# Altium project Hackster.PrjPcb
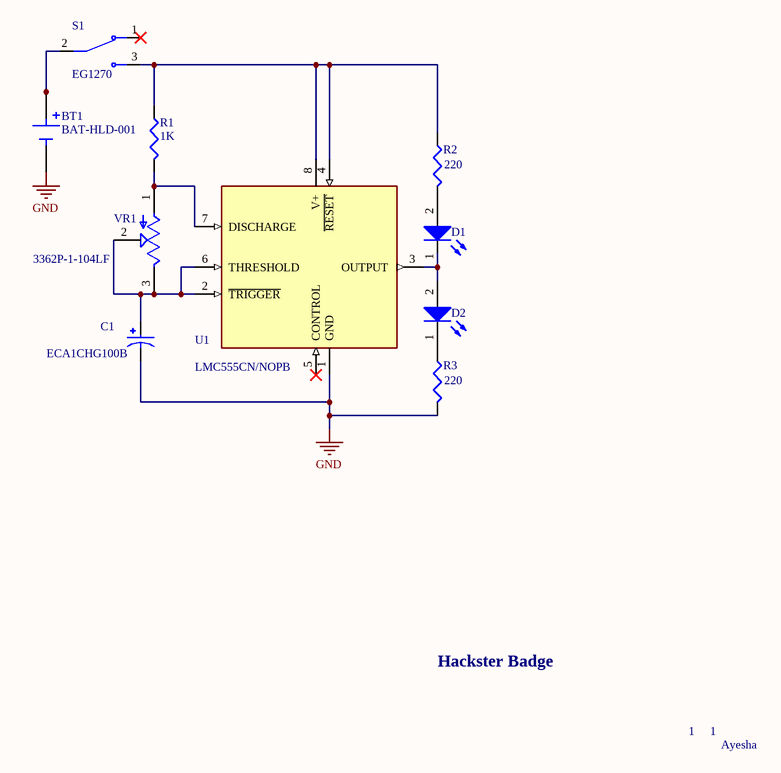
[diagram p0: Hackster.SchDoc]
1 sheet, 10 parts. Net scope: global (net labels, ports and power ports of the same name join across sheets).
Board file: hackster1.PcbDoc

## Sheet Hackster.SchDoc
size A; SheetNumber: 1; SheetTotal: 1

### Parts
BT1  BAT-HLD-001  [BAT_BAT-HLD-001]
C1  ECA1CHG100B  [CAPPRD500W50D500H1100]
D1  Blue, 2.8V, 30°  [WL-TMRW_D3.9H10.5]  (value not drawn)
D2  Blue, 2.8V, 30°  [WL-TMRW_D3.9H10.5]  (value not drawn)
R1  1K  [RESAD1100W55L680D260]
R2  220  [RESAD1100W55L680D260]
R3  220  [RESAD1100W55L680D260]
S1  EG1270  [SW_SS312SAH4-R]
U1  LMC555CN/NOPB  [DIP794W45P254L959H508Q8]
VR1  3362P-1-104LF  [TRIM_3362P-1-104LF]

### Nets
GND: BT1.N1(NEG) C1.N R3.2 U1.1(GND)
NetBT1_P1: BT1.P1(POS) BT1.P2(POS) S1.2
NetC1_P: C1.P U1.2(~{TRIGGER}) U1.6(THRESHOLD) VR1.2(WIPER) VR1.3(CW)
NetD1_1: D1.1(K) D2.2(A) U1.3(OUTPUT)
NetD1_2: D1.2(A) R2.2
NetD2_1: D2.1(K) R3.1
NetR1_1: R1.1 R2.1 S1.3 U1.4(~{RESET}) U1.8(V+)
NetR1_2: R1.2 U1.7(DISCHARGE) VR1.1(CCW)

Not connected (* = marked no-connect by the designer): S1 1*; U1 5(CONTROL)*

### Notes on the sheet
- Hackster Badge
- 1
- Ayesha

### Library data of the parts
BT1 = BAT-HLD-001: Battery Retainer Coin, 20.0mm 1 Cell SMD (SMT) Tab; Value: *; MP: BAT-HLD-001; Package: None; Availability: Unavailable; Price: None
C1 = ECA1CHG100B: Cap Aluminum Lytic 10uF 16V 20% (5 X 11mm) Radial 5mm 31mA 1000h 105C Automotive Ammo; MF: Panasonic Electronic; MP: ECA-1CHG100B; SnapEDA_Link: https://www.snapeda.com/parts/ECA-1CHG100B/Panasonic/view-part/?ref=snap; Package: RADIAL-2 Panasonic; Value: *; Check_prices: https://www.snapeda.com/parts/ECA-1CHG100B/Panasonic/view-part/?ref=eda
D1 D2 = 151033BS03000: WL-TMRW Mono-color Round Waterclear, THT, D3.9 x H10.5mm, Blue, 2.8V, 30°; Manufacturer: Wurth Elektronik; Chip Technology: InGaN; Dominant Wavelength: 470nm; Luminous Intensity: 3800mcd; Peak Wavelength: 465nm; Manufacturer Part Number: 151033BS03000; Category: Signal LEDs; Match Code: WL-TMRW; ComponentLink1Description: Website Link; ComponentLink1URL: https://www.we-online.com/redexpert/article/151033BS03000?ad; ComponentLink2Description: Datasheet Link; ComponentLink2URL: https://www.we-online.com/redexpert/spec/151033BS03000?ad; Mount: Through Hole; Operating Temperature Max: 85°C; Operating Temperature Min: -40°C; Packaging: Bulk; Height: 10.5mm; Diameter: 3.9mm; Emitting Color: Blue; Forward Voltage: 2.8V; Viewing Angle: 30°
R1-R3 = Res: Resistor
  R1: Value: 1K
  R2 R3: Value: 220
S1 = EG1270: Slide Switch SPDT Through Hole, Right Angle; MF: E-Switch; Availability: In Stock; Check_prices: https://www.snapeda.com/parts/EG1270/E-Switch/view-part/?ref=eda; SnapEDA_Link: https://www.snapeda.com/parts/EG1270/E-Switch/view-part/?ref=snap; Purchase-URL: https://pricing.snapeda.com/search/part/EG1270/?ref=eda; Package: None; MP: EG1270; Value: *; Price: None
U1 = LMC555CN/NOPB: Worldâ€™s smallest 555 timer with low power, high accuracy and a Fmax of 3MHz; MF: Texas Instruments; SnapEDA_Link: https://www.snapeda.com/parts/LMC555CN/NOPB/Texas+Instruments/view-part/?ref=snap; Package: PDIP-8 Texas; Value: *; MP: LMC555CN/NOPB; Check_prices: https://www.snapeda.com/parts/LMC555CN/NOPB/Texas+Instruments/view-part/?ref=eda
VR1 = 3362P-1-104LF: Res Cermet Trimmer 100K Ohm 10% 0.5W(1/2W) 1(Elec)/1(Mech)Turns 2.77mm (6.6 X 6.99 X 4.7mm) Pin Thru-Hole Tube; MF: Bourns Electronics; MP: 3362P1104LF; SnapEDA_Link: https://www.snapeda.com/parts/3362P1104LF/Bourns/view-part/?ref=snap; Package: 3362P-1 Bourns Inc.; Value: *; Check_prices: https://www.snapeda.com/parts/3362P1104LF/Bourns/view-part/?ref=eda